# EAGLE design main (EAGLE 9.5.2)
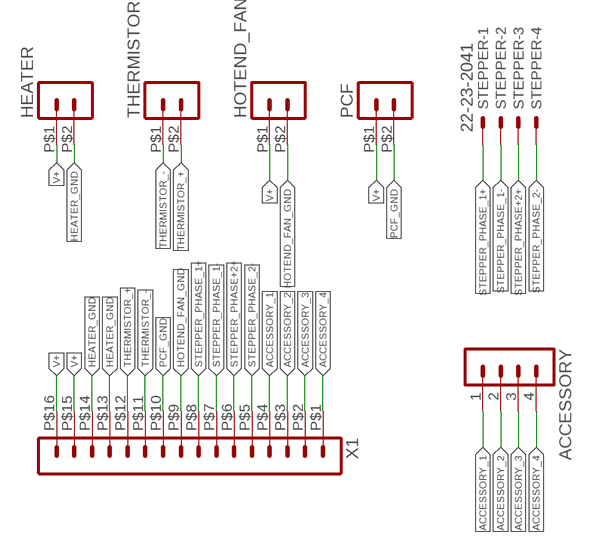
[diagram p0: schematic, sheet 1]

## Parts
ACCESSORY  MA04-1  [MA04-1]
HEATER  HEADER_POS2_43650-0224  [43650-0224]
HOTEND_FAN  HEADER_POS2_43650-0224  [43650-0224]
PCF  HEADER_POS2_43650-0224  [43650-0224]
STEPPER  22-23-2041  [22-23-2041]
THERMISTOR  HEADER_POS2_43650-0224  [43650-0224]
X1  HEADER_POS16_43045-1618  [43045-1618]

## Nets
ACCESSORY_1 [Accessory]: ACCESSORY.1 X1.P$4
ACCESSORY_2 [Accessory]: ACCESSORY.2 X1.P$3
ACCESSORY_3 [Accessory]: ACCESSORY.3 X1.P$2
ACCESSORY_4 [Accessory]: ACCESSORY.4 X1.P$1
HEATER_GND [Power]: HEATER.P$2 X1.P$13 X1.P$14
HOTEND_FAN_GND: HOTEND_FAN.P$2 X1.P$9
PCF_GND: PCF.P$2 X1.P$10
STEPPER_PHASE+2+ [Stepper]: STEPPER.3 X1.P$6
STEPPER_PHASE_1+ [Stepper]: STEPPER.1 X1.P$8
STEPPER_PHASE_1- [Stepper]: STEPPER.2 X1.P$7
STEPPER_PHASE_2- [Stepper]: STEPPER.4 X1.P$5
THERMISTOR_+: THERMISTOR.P$2 X1.P$12
THERMISTOR_-: THERMISTOR.P$1 X1.P$11
V+ [Power]: HEATER.P$1 HOTEND_FAN.P$1 PCF.P$1 X1.P$15 X1.P$16

## Library data of the parts
ACCESSORY = con-lstb:MA04-1: PIN HEADER; OC_FARNELL: unknown; OC_NEWARK: unknown
HEATER HOTEND_FAN PCF THERMISTOR = con-molex-micro-fit-3_0:HEADER_POS2_?: Molex - Micro-Fit 3.0 Series connector, 3.00mm (0.118") pitch header, 2 positions.
STEPPER = con-molex:22-23-2041: .100" (2.54mm) Center Header - 4 Pin; MF: MOLEX; MPN: 22-23-2041; OC_FARNELL: 1462920; OC_NEWARK: 38C0355
X1 = con-molex-micro-fit-3_0:HEADER_POS16_?: Molex - Micro-Fit 3.0 Series connector, 3.00mm (0.118") pitch header, 16 positions.

## Net classes
0 default: width 0.254 mm
1 Power: width 0.508 mm
2 Stepper: width 0.508 mm
3 Accessory: width 0.508 mm

## Board
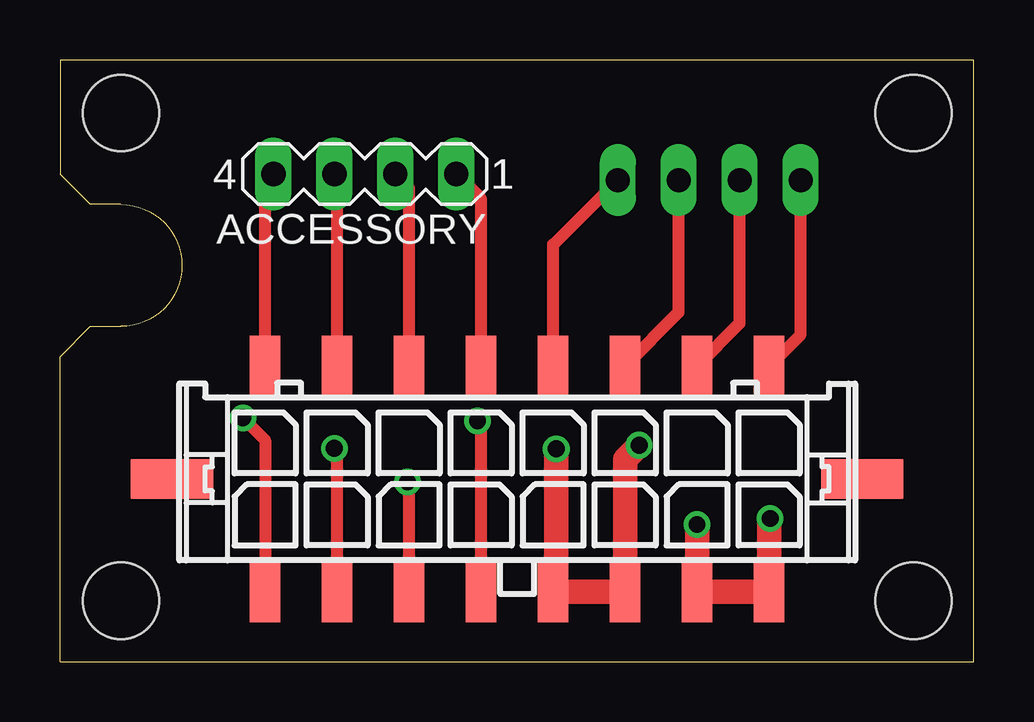
[diagram p1: board, top side]
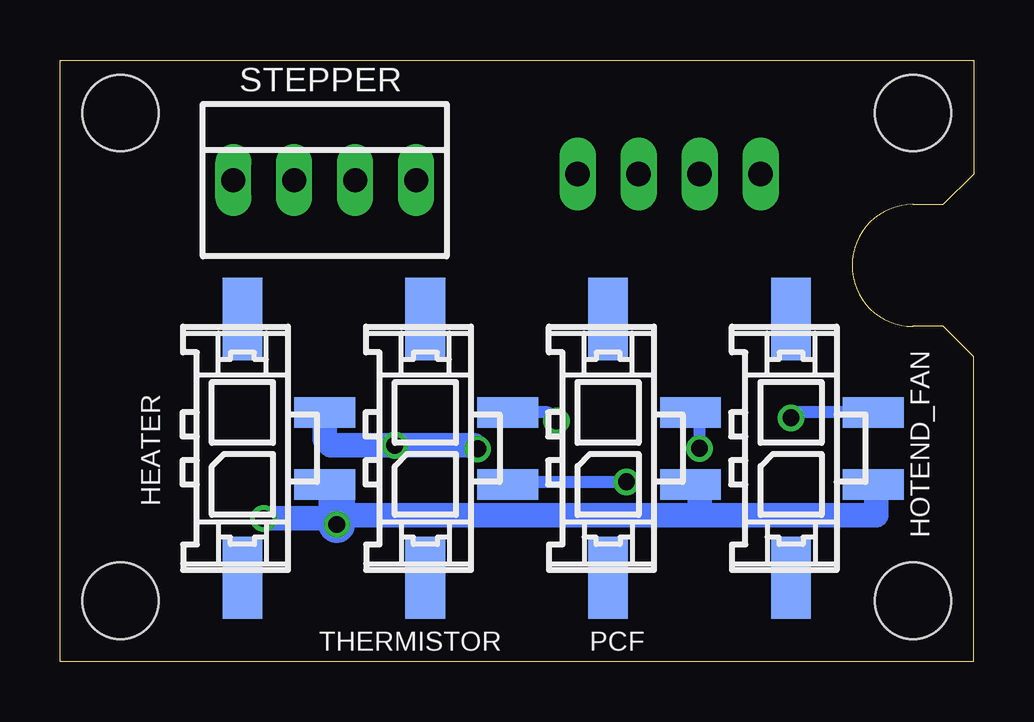
[diagram p2: board, bottom side, seen from below]

Size 38.08 x 25.07 mm. Coordinates in mm from the lower left corner, seen from the top.
Outline: 0,0 38.08,0 38.08,25.07 0,25.07 0,20.32 1.27,19.05 2.54,19.05 arc-180 2.54,13.97 1.27,13.97 0,12.7 0,0
Copper layers (1*16): Top 0.035mm / dielectric 1.5mm / Bottom 0.035mm
Design rules "default": minimum track width 6mil, minimum drill 0.35mm, track to track 6mil, track to pad 6mil, pad to pad 6mil, via to via 6mil, smd to smd 6mil, copper to edge 40mil, drill to drill 6mil, minimum pad ring 10mil, minimum via ring 8mil, stop-mask expansion 4mil, vias tented up to drill 0mil, thermal gap 10mil
Holes 3.17 mm at 2.54,22.86 2.54,2.54 35.56,2.54 35.56,22.86

### Footprints (pad centres in the part's own frame; a part is rotated, then mirrored left to right if it is on the bottom)
MA04-1 = drill 1.016 long: 1 -3.81,0; 2 -1.27,0; 3 1.27,0; 4 3.81,0
43650-0224 = smd 1.27 x 2.54: P$1 1.5,3.43; P$2 -1.5,3.43 | smd 3.43 x 1.65: TAB1 5.39,0; TAB2 -5.39,0
22-23-2041 = drill 1 long: 1 -3.81,0; 2 -1.27,0; 3 1.27,0; 4 3.81,0
43045-1618 = smd 3.43 x 1.65: CLIP1 -14.38,0; CLIP2 14.38,0 | smd 1.27 x 2.54: P$1 10.5,-4.7; P$2 7.5,-4.7; P$3 4.5,-4.7; P$4 1.5,-4.7; P$5 -1.5,-4.7; P$6 -4.5,-4.7; P$7 -7.5,-4.7; P$8 -10.5,-4.7; P$9 10.5,4.7; P$10 7.5,4.7; P$11 4.5,4.7; P$12 1.5,4.7; P$13 -1.5,4.7; P$14 -4.5,4.7; P$15 -7.5,4.7; P$16 -10.5,4.7

### Placement (x,y rotation side)
ACCESSORY  12.7,20.32 180 top
HEATER  30.48,8.89 270 bottom
HOTEND_FAN  7.62,8.89 270 bottom
PCF  15.24,8.89 270 bottom
STEPPER  27.05,20.07 0 bottom
THERMISTOR  22.86,8.89 270 bottom
X1  19.05,7.62 180 top

### Tracks (layer width: path | path; a pad name or v marks a point on that pad's centre or on a via)
ACCESSORY_1
  Top 0.508: X1.P$4 17.55,19.28 ACCESSORY.1
ACCESSORY_2
  Top 0.508: X1.P$3 14.55,19.74 ACCESSORY.2
ACCESSORY_3
  Top 0.508: X1.P$2 11.55,20.2 ACCESSORY.3
ACCESSORY_4
  Top 0.508: X1.P$1 8.55,19.98 ACCESSORY.4
HEATER_GND  (via drill 0.7)
  Top 1.016: v20.68,8.87 20.68,3.05 X1.P$13 X1.P$14 23.55,8.44 v24.13,9.02
  Bottom 1.016: v20.68,8.87 20.83,9.02 v24.13,9.02 26.8,9.02 27.05,9.27 HEATER.P$2
HOTEND_FAN_GND  (via drill 0.7)
  Top 0.508: v7.62,10.16 8.55,9.23 X1.P$9
  Bottom 0.508: HOTEND_FAN.P$2 7.39,10.39 v7.62,10.16
PCF_GND  (via drill 0.7)
  Top 0.508: X1.P$10 11.55,8.77 v11.43,8.89
  Bottom 0.508: v11.43,8.89 11.43,10.01 PCF.P$2
STEPPER_PHASE+2+
  Top 0.508: X1.P$6 25.78,14.55 STEPPER.3
STEPPER_PHASE_1+
  Top 0.508: X1.P$8 30.86,13.63 STEPPER.1
STEPPER_PHASE_1-
  Top 0.508: X1.P$7 28.32,14.09 STEPPER.2
STEPPER_PHASE_2-
  Top 0.508: X1.P$5 20.55,17.38 STEPPER.4
THERMISTOR_+  (via drill 0.7)
  Top 0.508: X1.P$12 17.55,9.88 v17.4,10.03
  Bottom 0.508: v17.4,10.03 17.76,10.39 THERMISTOR.P$2
THERMISTOR_-  (via drill 0.7)
  Top 0.508: X1.P$11 14.55,7.42 v14.48,7.49
  Bottom 0.508: THERMISTOR.P$1 19.33,7.49 v14.48,7.49
V+  (via drill 0.7)
  Top 1.016: v26.54,5.71 v26.55,5.71 X1.P$15 X1.P$16 29.55,5.93 v29.59,5.97
  Bottom 1.016: 26.54,6.88 HEATER.P$1 | 11.43,6.1 17.89,6.1 17.89,6.09 26.16,6.09 v26.54,5.71 26.8,5.97 v29.59,5.97 | 11.43,6.1 4.06,6.1 4.06,7.26 HOTEND_FAN.P$1 | PCF.P$1 11.43,7.01 11.43,6.1
  Bottom 1.524: v26.54,5.71 26.54,6.88